# EasyEDA schematic SCH_sfstgr_2023-11-16.json
TITLE: Sheet_1; REV: 1.0; Date: 2023-11-15; Sheet: 1/1; Company: Your Company
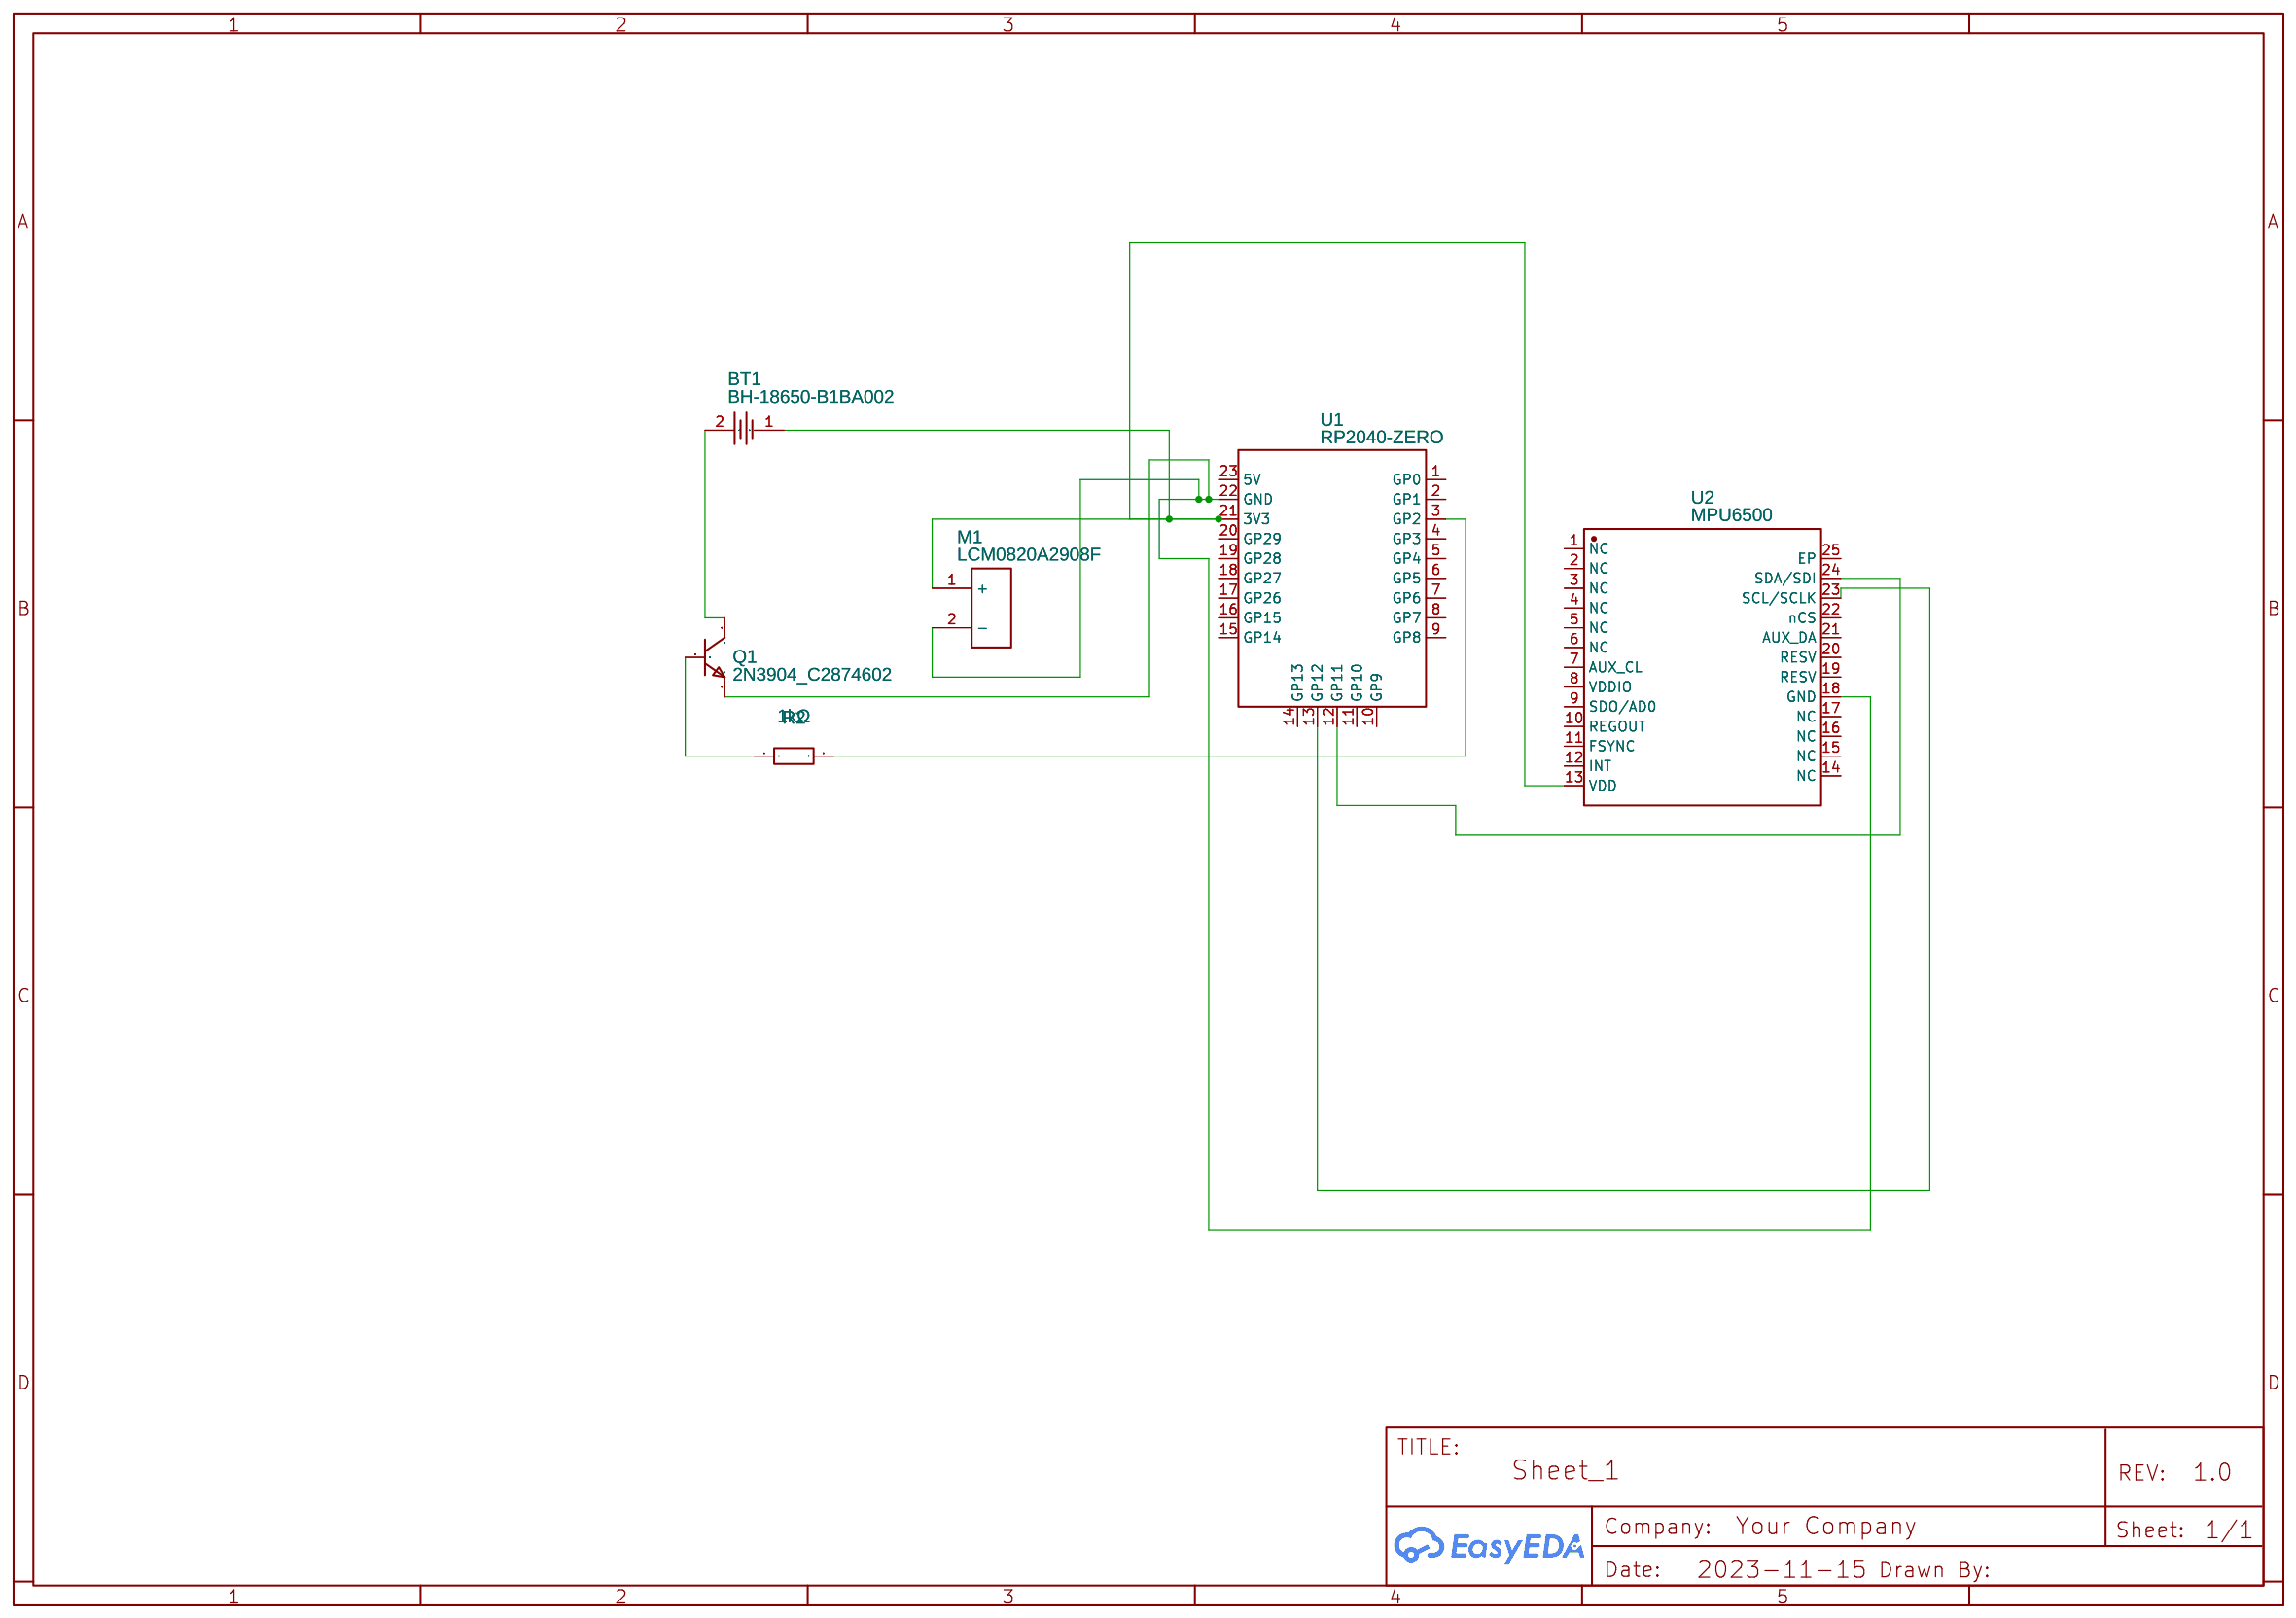
[diagram p0: schematic sheet]

## Parts
BT1  BH-18650-B1BA002  [BATTERY-SMD_18650-1S-L77.1-W20.7-1]
M1  LCM0820A2908F  [LCM0820A2908F]
Q1  2N3904_C2874602  [TO-92-3_L4.6-W3.6-P1.30-L_2N3904]
R2  1kΩ  [R0402]
U1  RP2040-ZERO  [COMM-SMD_RP2040-ZERO]
U2  MPU6500  [QFN-24_L3.0-W3.0-P0.40-BL-EP]

## Library data of the parts
BT1 = BH-18650-B1BA002: Contributor: lcsc; Supplier: LCSC; Supplier Part: C2988620; Manufacturer: MYOUNG(美阳); JLCPCB Part Class: Extended Part; link: https://lcsc.com/eda_search?q=C2988620&%26type=1&ref=editor
M1 = LCM0820A2908F: Supplier: LCSC; Supplier Part: C2682302; link: https://datasheet.lcsc.com/lcsc/2106070438_LEADER-LCM0820A2908F_C2682302.pdf; Contributor: trty69230
Q1 = 2N3904_C2874602: Contributor: LCSC; Supplier: LCSC; Supplier Part: C2874602; Manufacturer: JSMSEMI(杰盛微); Manufacturer Part: 2N3904; JLCPCB Part Class: Extended Part; link: https://lcsc.com/eda_search?q=C2874602&%26type=1&ref=editor
R2 = QR0402F1KQ10: Contributor: LCSC; Supplier: LCSC; Supplier Part: C176101; Manufacturer: EVER OHMS(天二科技); Manufacturer Part: QR0402F1K00Q10Z; JLCPCB Part Class: Extended Part; link: https://lcsc.com/eda_search?q=C176101&%26type=1&ref=editor
U1 = RP2040-ZERO: Supplier: LCSC; Supplier Part: C5350143; Manufacturer: Waveshare(微雪电子); Manufacturer Part: RP2040-Zero; JLCPCB Part Class: Extended Part; Contributor: lcsc; link: https://lcsc.com/eda_search?q=C5350143&%26type=1&ref=editor
U2 = MPU6500: Supplier: LCSC; Manufacturer: TDK InvenSense(应美盛); Supplier Part: C50278; JLCPCB Part Class: Extended Part; link: https://lcsc.com/eda_search?q=C50278&%26type=1&ref=editor

## Nets
Net-(BT1-1): BT1.1 M1.1(+) U1.21(3V3) U2.13(VDD)
Net-(BT1-2): BT1.2 Q1.3(C)
Net-(M1-2): M1.2(-) Q1.1(E) U1.22(GND) U2.18(GND)
Net-(Q1-2): Q1.2(B) R2.1
Net-(R2-2): R2.2 U1.3(GP2)
Net-(U1-12): U1.12(GP11) U2.24(SDA/SDI)
Net-(U1-13): U1.13(GP12) U2.23(SCL/SCLK)

Not connected (* = marked no-connect by the designer): U1 1(GP0) 2(GP1) 4(GP3) 5(GP4) 6(GP5) 7(GP6) 8(GP7) 9(GP8) 10(GP9) 11(GP10) 14(GP13) 15(GP14) 16(GP15) 17(GP26) 18(GP27) 19(GP28) 20(GP29) 23(5V); U2 1(NC) 2(NC) 3(NC) 4(NC) 5(NC) 6(NC) 7(AUX_CL) 8(VDDIO) 9(SDO/AD0) 10(REGOUT) 11(FSYNC) 12(INT) 14(NC) 15(NC) 16(NC) 17(NC) 19(RESV) 20(RESV) 21(AUX_DA) 22(nCS) 25(EP)
